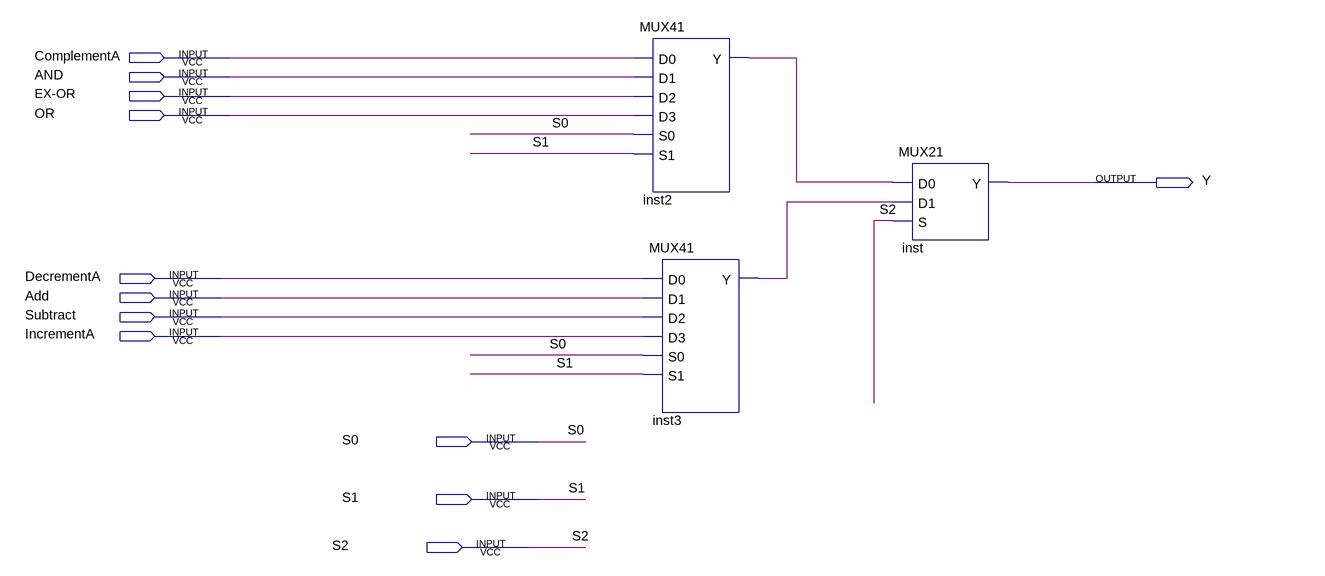
[diagram p0: schematic sheet]
// Quartus schematic mux81.bdf as structural Verilog: 3 symbols, 12 pins
module mux81 (
  input  ComplementA,
  input  AND,
  input  \EX-OR ,
  input  OR,
  input  DecrementA,
  input  Add,
  input  Subtract,
  input  IncrementA,
  input  S0,
  input  S1,
  input  S2,
  output Y
);

  wire inst2_y, inst3_y;

  MUX41 inst2 (.D0(ComplementA), .D1(AND), .D2(\EX-OR ), .D3(OR), .S0(S0), .S1(S1), .Y(inst2_y));
  MUX41 inst3 (.D0(DecrementA), .D1(Add), .D2(Subtract), .D3(IncrementA), .S0(S0), .S1(S1), .Y(inst3_y));
  MUX21 inst (.D0(inst2_y), .D1(inst3_y), .S(S2), .Y(Y));
endmodule
